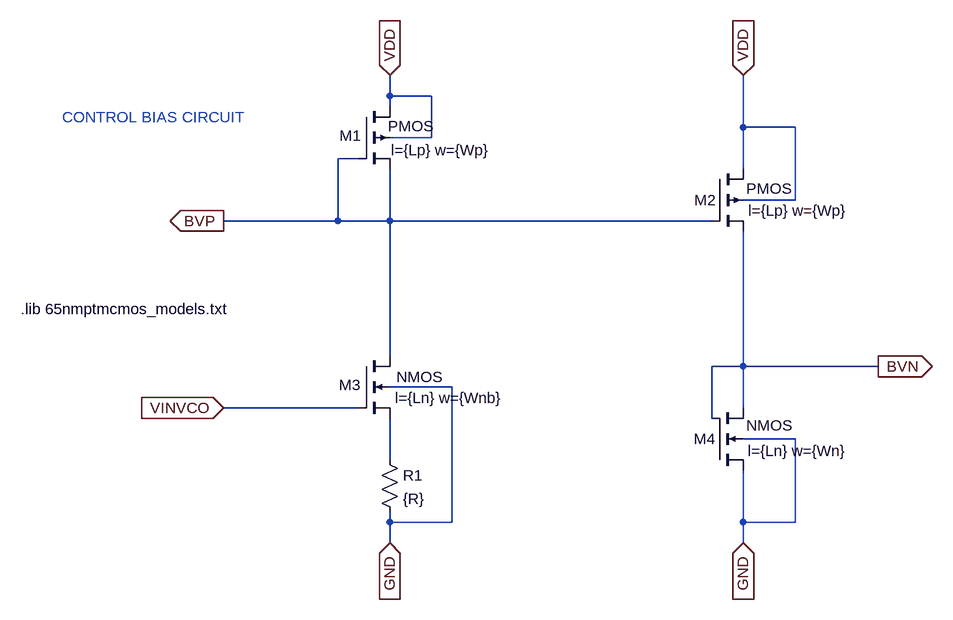
[diagram p0: schematic Bias.asc]
Bias.asc, the LTspice schematic file:
Version 4
SHEET 1 1292 832
WIRE 80 32 80 0
WIRE 144 32 80 32
WIRE 80 48 80 32
WIRE 624 80 624 0
WIRE 704 80 624 80
WIRE 144 96 144 32
WIRE 144 96 80 96
WIRE 32 128 0 128
WIRE 624 144 624 80
WIRE 704 192 704 80
WIRE 704 192 624 192
WIRE 0 224 0 128
WIRE 0 224 -176 224
WIRE 80 224 80 144
WIRE 80 224 0 224
WIRE 576 224 80 224
WIRE 80 432 80 224
WIRE 624 448 624 240
WIRE 624 448 576 448
WIRE 832 448 624 448
WIRE 176 480 80 480
WIRE 32 512 -176 512
WIRE 624 512 624 448
WIRE 576 528 576 448
WIRE 704 560 624 560
WIRE 80 592 80 528
WIRE 80 688 80 672
WIRE 176 688 176 480
WIRE 176 688 80 688
WIRE 624 688 624 608
WIRE 704 688 704 560
WIRE 704 688 624 688
WIRE 80 720 80 688
WIRE 624 720 624 688
FLAG 832 448 BVN
IOPIN 832 448 Out
FLAG 80 0 VDD
IOPIN 80 0 In
FLAG 624 0 VDD
IOPIN 624 0 In
FLAG -176 224 BVP
IOPIN -176 224 Out
FLAG 80 720 GND
IOPIN 80 720 In
FLAG 624 720 GND
IOPIN 624 720 In
FLAG -176 512 VINVCO
IOPIN -176 512 In
SYMBOL res 64 576 R0
SYMATTR InstName R1
SYMATTR Value {R}
SYMBOL pmos4 32 48 R0
WINDOW 123 50 67 Left 2
WINDOW 0 -29 45 Left 2
WINDOW 3 45 30 Left 2
SYMATTR Value2 l={Lp} w={Wp}
SYMATTR InstName M1
SYMBOL pmos4 576 144 R0
WINDOW 123 56 64 Left 2
WINDOW 0 -27 48 Left 2
WINDOW 3 53 30 Left 2
SYMATTR Value2 l={Lp} w={Wp}
SYMATTR InstName M2
SYMBOL nmos4 32 432 R0
WINDOW 123 56 65 Left 2
WINDOW 0 -30 45 Left 2
WINDOW 3 58 32 Left 2
SYMATTR Value2 l={Ln} w={Wnb}
SYMATTR InstName M3
SYMBOL nmos4 576 608 M180
WINDOW 123 55 30 Left 2
WINDOW 0 -28 48 Left 2
WINDOW 3 53 69 Left 2
SYMATTR Value2 l={Ln} w={Wn}
SYMATTR InstName M4
TEXT -488 360 Left 2 !.lib 65nmptmcmos_models.txt
TEXT -424 64 Left 2 ;CONTROL BIAS CIRCUIT

The netlist it stands for:
* Bias.asc
R1 N001 GND {R}
M1 VDD BVP BVP VDD PMOS l={Lp} w={Wp}
M2 VDD BVP BVN VDD PMOS l={Lp} w={Wp}
M3 BVP VINVCO N001 GND NMOS l={Ln} w={Wnb}
M4 GND BVN BVN GND NMOS l={Ln} w={Wn}
.model NMOS NMOS
.model PMOS PMOS
.lib standard.mos
.lib 65nmptmcmos_models.txt
* CONTROL BIAS CIRCUIT
.backanno
.end